# Altium project f401ccu6_w25q64_20210612.PrjPcb
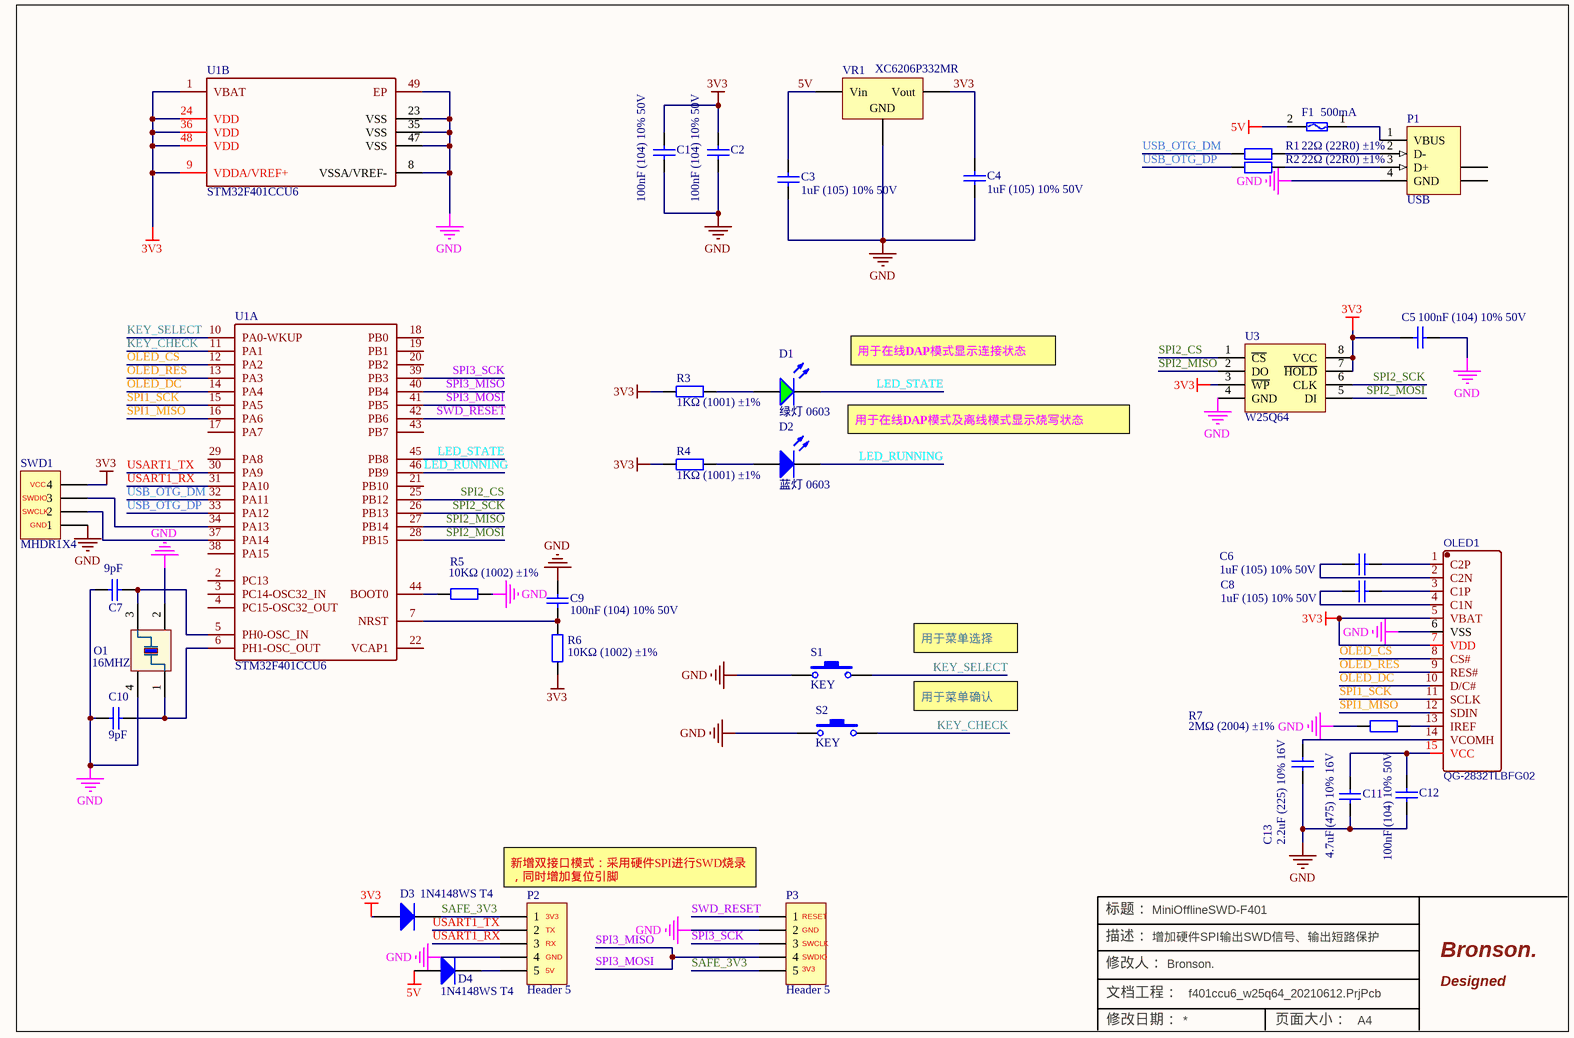
[diagram p0: f401ccu6_w25q64_20210612.SchDoc]
1 sheet, 36 parts. Net scope: global (net labels, ports and power ports of the same name join across sheets).
Board file: f401ccu6_w25q64_20210612.PcbDoc

## Sheet f401ccu6_w25q64_20210612.SchDoc: MiniOfflineSWD-F401
size A4; Author: Bronson.; Address1: 增加硬件SPI输出SWD信号、输出短路保护

### Parts
C1  100nF (104) 10% 50V  [0805L]
C2  100nF (104) 10% 50V  [C0603]
C3  1uF (105) 10% 50V  [0805L]
C4  1uF (105) 10% 50V  [C0603]
C5  100nF (104) 10% 50V  [C0603]
C6  1uF (105) 10% 50V  [C0603]
C7  9pF  [C0603]
C8  1uF (105) 10% 50V  [C0603]
C9  100nF (104) 10% 50V  [C0603]
C10  9pF  [C0603]
C11  4.7uF (475) 10% 16V  [C0603]
C12  100nF (104) 10% 50V  [C0603]
C13  2.2uF (225) 10% 16V  [C0603]
D1  绿灯 0603  [LED_0603_GREEN]
D2  蓝灯 0603  [LED_0603_BLUE]
D3  1N4148WS T4  [SOD-323]
D4  1N4148WS T4  [SOD-323]
F1  500mA  [0603]
O1  16MHZ  [OSC 3225-4P]
OLED1  QG-2832TLBFG02  [0.91-OLED]
P1  USB  [USB_A/P_B]
P2  Header 5  [PinHeader_5]
P3  Header 5  [PinHeader_5]
R1  22Ω (22R0) ±1%  [RES0603]
R2  22Ω (22R0) ±1%  [RES0603]
R3  1KΩ (1001) ±1%  [RES0603]
R4  1KΩ (1001) ±1%  [RES0603]
R5  10KΩ (1002) ±1%  [RES0603]
R6  10KΩ (1002) ±1%  [RES0603]
R7  2MΩ (2004) ±1%  [RES0603]
S1  KEY  [KEY]
S2  KEY  [KEY]
SWD1  MHDR1X4  [MHDR1X4]
U1  STM32F401CCU6  [UFQFPN-48_L7.0-W7.0-P0.50-BL-EP]  (parts A,B of 2)
U3  W25Q64  [SOP8_W]
VR1  XC6206P332MR  [SOT-23-3L]

### Nets
3V3: C1.2 C2.2 C4.2 C5.1 D3.1(A) OLED1.5(VBAT) OLED1.7(VDD) R3.2 R4.2 R6.2 SWD1.4 U1.1(VBAT) U1.9(VDDA/VREF+) U1.24(VDD) U1.36(VDD) U1.48(VDD) U3.3(~{WP}) U3.7(~{HOLD}) U3.8(VCC) VR1.2(Vout)
5V: C3.2 D4.1(A) F1.2 VR1.3(Vin)
GND: C1.1 C2.1 C3.1 C4.1 C5.2 C7.2 C9.1 C10.2 C11.1 C12.1 C13.1 O1.2 O1.4 OLED1.6(VSS) P1.4(GND) P2.4 P3.2 R5.1 R7.1 S1.1 S2.1 SWD1.1 U1.8(VSSA/VREF-) U1.23(VSS) U1.35(VSS) U1.47(VSS) U1.49(EP) U3.4(GND) VR1.1(GND)
KEY_CHECK: S2.2 U1.11(PA1)
KEY_SELECT: S1.2 U1.10(PA0-WKUP)
LED_RUNNING: D2.1 U1.46(PB9)
LED_STATE: D1.1 U1.45(PB8)
OLED_CS: OLED1.8(CS#) U1.12(PA2)
OLED_DC: OLED1.10(D/C#) U1.14(PA4)
OLED_RES: OLED1.9(RES#) U1.13(PA3)
SAFE_3V3: D3.2(K) P2.1 P3.5
SPI1_MISO: OLED1.12(SDIN) U1.16(PA6)
SPI1_SCK: OLED1.11(SCLK) U1.15(PA5)
SPI2_CS: U1.25(PB12) U3.1(~{CS})
SPI2_MISO: U1.27(PB14) U3.2(DO)
SPI2_MOSI: U1.28(PB15) U3.5(DI)
SPI2_SCK: U1.26(PB13) U3.6(CLK)
SPI3_MISO: P3.4 U1.40(PB4) U1.41(PB5)  [also labelled SPI3_MOSI]
SPI3_SCK: P3.3 U1.39(PB3)
SWD_RESET: P3.1 U1.42(PB6)
USART1_RX: P2.3 U1.31(PA10)
USART1_TX: P2.2 U1.30(PA9)
USB_OTG_DM: R1.1 U1.32(PA11)
USB_OTG_DP: R2.1 U1.33(PA12)
NetC6_1: C6.1 OLED1.2(C2N)
NetC6_2: C6.2 OLED1.1(C2P)
NetC7_1: C7.1 O1.3 U1.5(PH0-OSC_IN)
NetC8_1: C8.1 OLED1.4(C1N)
NetC8_2: C8.2 OLED1.3(C1P)
NetC9_2: C9.2 R6.1 U1.7(NRST)
NetC10_1: C10.1 O1.1 U1.6(PH1-OSC_OUT)
NetC11_2: C11.2 C12.2 OLED1.15(VCC)
NetC13_2: C13.2 OLED1.14(VCOMH)
NetD1_2: D1.2 R3.1
NetD2_2: D2.2 R4.1
NetD4_2: D4.2(K) P2.5
NetF1_1: F1.1 P1.1(VBUS)
NetOLED1_13: OLED1.13(IREF) R7.2
NetP1_2: P1.2(D-) R1.2
NetP1_3: P1.3(D+) R2.2
NetR5_2: R5.2 U1.44(BOOT0)
NetSWD1_2: SWD1.2 U1.37(PA14)
NetSWD1_3: SWD1.3 U1.34(PA13)

Not connected (* = marked no-connect by the designer): P1 5(SHLD) 6(SHLD); U1 2(PC13) 3(PC14-OSC32_IN) 4(PC15-OSC32_OUT) 17(PA7) 18(PB0) 19(PB1) 20(PB2) 21(PB10) 22(VCAP1) 29(PA8) 38(PA15) 43(PB7)

### Notes on the sheet
- 用于在线DAP模式显示连接状态
- 用于在线DAP模式及离线模式显示烧写状态
- (near SWD1) SWCLK
- (near SWD1) SWDIO
- (near SWD1) VCC
- (near SWD1) GND
- 用于菜单选择
- 用于菜单确认
- 新增双接口模式：采用硬件SPI进行SWD烧录，同时增加复位引脚
- (near P2) 3V3
- (near P3) RESET
- (near P2) TX
- (near P2) RX
- (near P2) GND
- (near P2) 5V
- (near P3) GND
- (near P3) SWCLK
- (near P3) SWDIO
- (near P3) 3V3
- 标题：
- 描述：
- 修改人：
- Bronson.
- Designed
- 文档工程：
- 修改日期：
- 页面大小：
- A4

### Library data of the parts
C1 C2 C5 C9 C12 = 0603 100nF (104) 10%: 贴片电容; ComponentLink1Description: 供应商链接; ComponentLink1URL: http://www.szlcsc.com/product/details_15331.html; Package: 0603; Supplier: LC; SuppliersPartNumber: C14663
C3 C4 C6 C8 = 0603 1uF (105) 10%: 贴片电容; ComponentLink1Description: 供应商链接; ComponentLink1URL: http://www.szlcsc.com/product/details_16531.html; Package: 0603; Supplier: LC; SuppliersPartNumber: C15849
C7 C10 = 0603 22pF (220) 5%: 贴片电容; ComponentLink1Description: 供应商链接; ComponentLink1URL: http://www.szlcsc.com/product/details_2005.html; Package: 0603; Supplier: LC; SuppliersPartNumber: C1653
C11 = 0603 4.7uF (475) 10%: 贴片电容; ComponentLink1Description: 供应商链接; ComponentLink1URL: http://www.szlcsc.com/product/details_20375.html; Package: 0603; Supplier: LC; SuppliersPartNumber: C19666
C13 = 0603 2.2uF (225) 10%: 贴片电容; ComponentLink1Description: 供应商链接; ComponentLink1URL: http://www.szlcsc.com/product/details_24366.html; Package: 0603; Supplier: LC; SuppliersPartNumber: C23630
D1 = 0603 绿灯: 发光二极管; ComponentLink1Description: 供应商链接; ComponentLink1URL: http://www.szlcsc.com/product/details_73152.html; Package: 0603; Supplier: LC; SuppliersPartNumber: C72043
D2 = 0603 蓝灯: 发光二极管; ComponentLink1Description: 供应商链接; ComponentLink1URL: http://www.szlcsc.com/product/details_73150.html; Package: 0603; Supplier: LC; SuppliersPartNumber: C72041
D3 D4 = SOD-323 1N4148WS T4: 二极管; ComponentLink1Description: 供应商链接; ComponentLink1URL: http://www.szlcsc.com/product/details_2485.html; Package: SOD-323; Supplier: LC; SuppliersPartNumber: C2128
F1 = FUSE: 保险丝，熔断丝
O1 = OSC
OLED1 = 0.91-OLED: BOM_Manufacturer: Allvision; Contributor: LCSC; BOM_Supplier: LCSC; BOM_Manufacturer Part: QG-2832TLBFG02; BOM_Supplier Part: C91220; spicePre: O; spiceSymbolName: QG-2832TLBFG02
P1 = 1470695-2: USB 1.1, Right Angle, SMT, A Type, Plug, 4 Position, Natural; ContactMaterial: Brass; ContactPlating: Gold (30) over Nickel (50); PCB_Layout: Complies with manufacturer's recommendation.; DrillSize: Corresponds to nominal value.; PanelGround: Without; Published: 15-Jul-2004; DatasheetDocument: 21-Jan-2003; PackageDocument: 21-Jan-2003; PackageReference: 1470695A; Publisher: Altium Limited; HousingMaterial: Thermoplastic; ComponentLink1Description: Manufacturer Link; ComponentLink1URL: http://www.tycoelectronics.com/; ComponentLink2Description: Packaging Specification; ComponentLink2URL: http://ecommas.tycoelectronics.com/commerce/DocumentDelivery/DDEController?Action=showdoc&DocId=Customer+Drawing%7F1470695%7FO%7Fpdf%7FEnglish%7FC_1470695_O.pdf
P2 P3 = Header 5: Header, 5-Pin; LatestRevisionDate: 17-Jul-2002; LatestRevisionNote: Re-released for DXP Platform.; Publisher: Altium Limited
R1 R2 = 0603 22Ω (22: 贴片电阻; ComponentLink1Description: 供应商链接; ComponentLink1URL: http://www.szlcsc.com/product/details_24078.html; Package: 0603; Supplier: LC; SuppliersPartNumber: C23345
R3 R4 = 0603 1KΩ (10: 贴片电阻; ComponentLink1Description: 供应商链接; ComponentLink1URL: http://www.szlcsc.com/product/details_21904.html; Package: 0603; Supplier: LC; SuppliersPartNumber: C21190
R5 R6 = 0603 10KΩ (10: 贴片电阻; ComponentLink1Description: 供应商链接; ComponentLink1URL: http://www.szlcsc.com/product/details_26547.html; Package: 0603; Supplier: LC; SuppliersPartNumber: C25804
R7 = 0603 2MΩ (20: 贴片电阻; ComponentLink1Description: 供应商链接; ComponentLink1URL: http://www.szlcsc.com/product/details_23703.html; Package: 0603; Supplier: LC; SuppliersPartNumber: C22976
SWD1 = MHDR1X4: Header, 4-Pin; LatestRevisionDate: 17-Jul-2002; LatestRevisionNote: Re-released for DXP Platform.; Publisher: Altium Limited
U3 = W25Q
VR1 = SOT-23 XC620: 低压差线性稳压(LDO); ComponentLink1Description: 供应商链接; ComponentLink1URL: http://www.szlcsc.com/product/details_5896.html; Package: SOT-23; Supplier: LC; SuppliersPartNumber: C5446